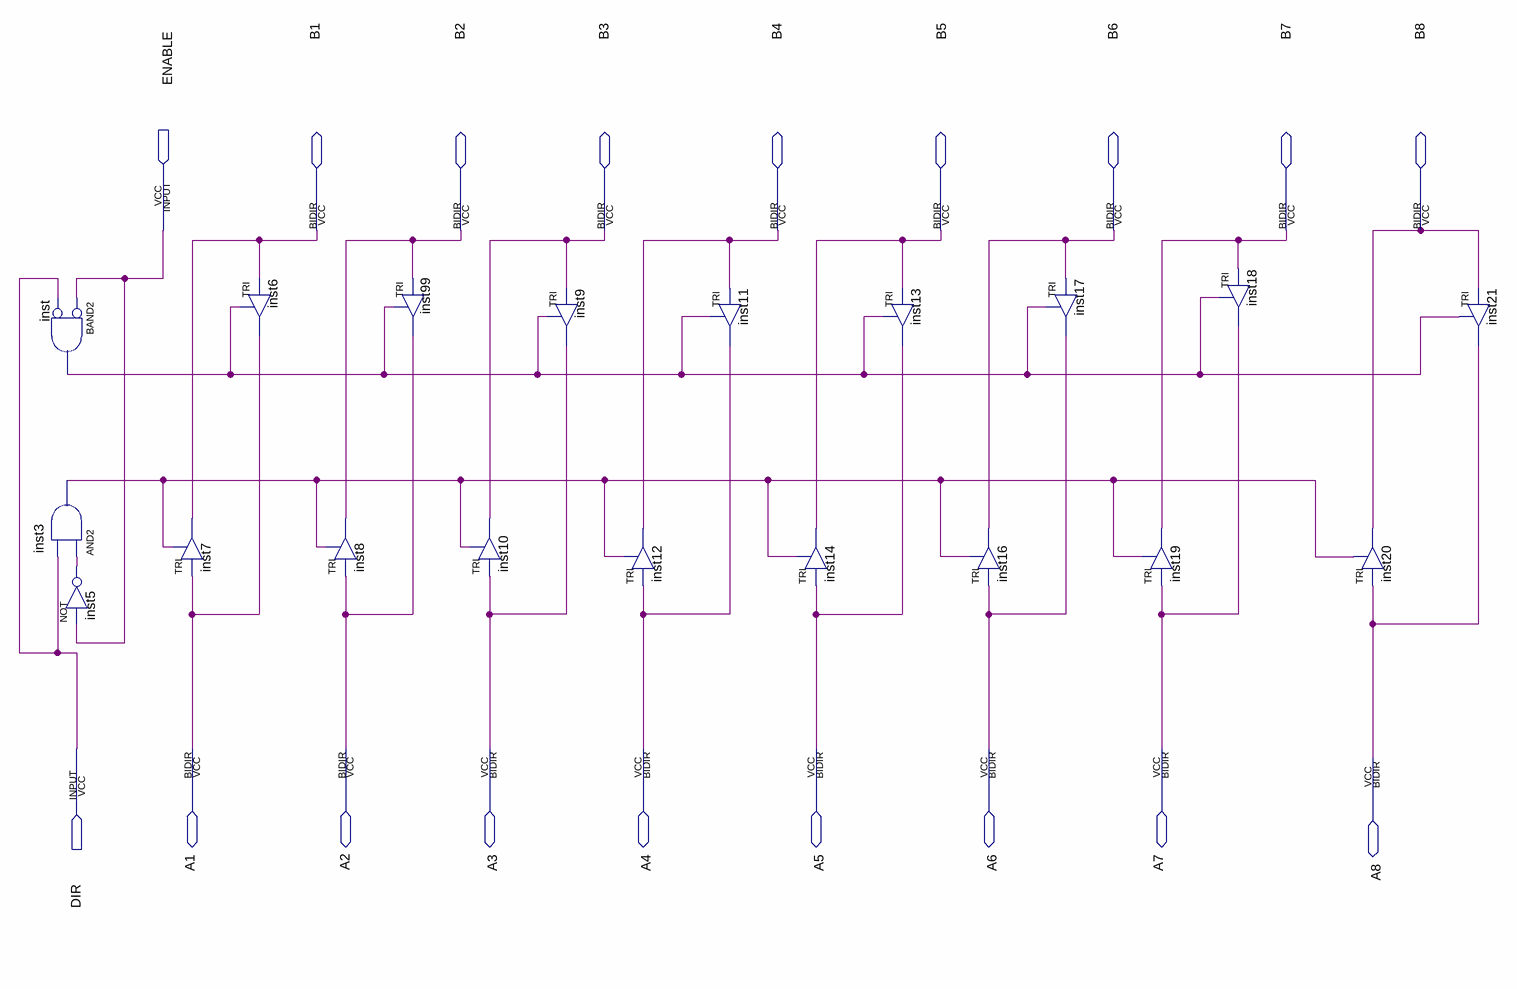
[diagram p0: schematic sheet]
// Quartus schematic CI74LS245_BUFFER_TRISTATE.bdf as structural Verilog: 19 symbols, 18 pins
module CI74LS245_BUFFER_TRISTATE (
  input  ENABLE,
  input  DIR,
  inout  B1,
  inout  B2,
  inout  B3,
  inout  B4,
  inout  B5,
  inout  B6,
  inout  B7,
  inout  B8,
  inout  A1,
  inout  A2,
  inout  A3,
  inout  A4,
  inout  A5,
  inout  A6,
  inout  A7,
  inout  A8
);

  wire inst3_out, inst5_out, inst_out;

  and inst (inst_out, ~ENABLE, ~DIR);  // BAND2
  and inst3 (inst3_out, inst5_out, DIR);
  not inst5 (inst5_out, ENABLE);
  TRI inst7 (.IN(A1), .OE(inst3_out), .OUT(B1));
  TRI inst6 (.IN(B1), .OE(inst_out), .OUT(A1));
  TRI inst8 (.IN(A2), .OE(inst3_out), .OUT(B2));
  TRI inst99 (.IN(B2), .OE(inst_out), .OUT(A2));
  TRI inst10 (.IN(A3), .OE(inst3_out), .OUT(B3));
  TRI inst9 (.IN(B3), .OE(inst_out), .OUT(A3));
  TRI inst12 (.IN(A4), .OE(inst3_out), .OUT(B4));
  TRI inst11 (.IN(B4), .OE(inst_out), .OUT(A4));
  TRI inst14 (.IN(A5), .OE(inst3_out), .OUT(B5));
  TRI inst13 (.IN(B5), .OE(inst_out), .OUT(A5));
  TRI inst16 (.IN(A6), .OE(inst3_out), .OUT(B6));
  TRI inst17 (.IN(B6), .OE(inst_out), .OUT(A6));
  TRI inst19 (.IN(A7), .OE(inst3_out), .OUT(B7));
  TRI inst18 (.IN(B7), .OE(inst_out), .OUT(A7));
  TRI inst20 (.IN(A8), .OE(inst3_out), .OUT(B8));
  TRI inst21 (.IN(B8), .OE(inst_out), .OUT(A8));
endmodule
